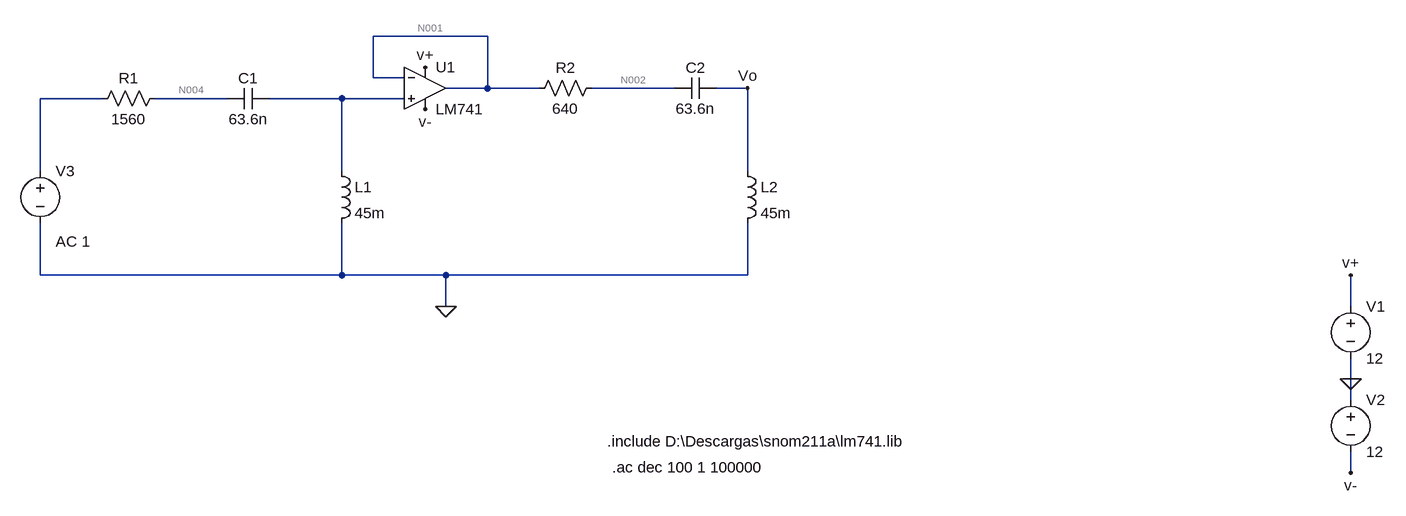
[diagram p0: schematic TS3.asc]
TS3.asc, the LTspice schematic file:
Version 4
SHEET 1 2296 964
WIRE 912 224 736 224
WIRE 736 288 736 224
WIRE 784 288 736 288
WIRE 912 304 912 224
WIRE 912 304 848 304
WIRE 992 304 912 304
WIRE 1200 304 1072 304
WIRE 1312 304 1264 304
WIRE 320 320 224 320
WIRE 512 320 400 320
WIRE 688 320 576 320
WIRE 784 320 688 320
WIRE 224 432 224 320
WIRE 688 432 688 320
WIRE 1312 432 1312 304
WIRE 224 592 224 512
WIRE 688 592 688 512
WIRE 688 592 224 592
WIRE 848 592 688 592
WIRE 1312 592 1312 512
WIRE 1312 592 848 592
WIRE 848 640 848 592
WIRE 2240 640 2240 592
WIRE 2240 752 2240 720
WIRE 2240 784 2240 752
WIRE 2240 896 2240 864
FLAG 2240 752 0
FLAG 2240 592 v+
FLAG 2240 896 v-
FLAG 816 272 v+
FLAG 816 336 v-
FLAG 848 640 0
FLAG 1312 304 Vo
SYMBOL voltage 2240 624 R0
WINDOW 123 0 0 Left 0
WINDOW 39 0 0 Left 0
SYMATTR InstName V1
SYMATTR Value 12
SYMBOL voltage 2240 768 R0
WINDOW 123 0 0 Left 0
WINDOW 39 0 0 Left 0
SYMATTR InstName V2
SYMATTR Value 12
SYMBOL OpAmps\\opamp2 816 240 R0
SYMATTR InstName U1
SYMATTR Value LM741
SYMBOL voltage 224 416 R0
WINDOW 123 24 124 Left 2
WINDOW 39 0 0 Left 0
SYMATTR InstName V3
SYMATTR Value ""
SYMATTR Value2 AC 1
SYMBOL res 416 304 R90
WINDOW 0 0 56 VBottom 2
WINDOW 3 32 56 VTop 2
SYMATTR InstName R1
SYMATTR Value 1560
SYMBOL cap 576 304 R90
WINDOW 0 0 32 VBottom 2
WINDOW 3 32 32 VTop 2
SYMATTR InstName C1
SYMATTR Value 63.6n
SYMBOL ind 672 416 R0
SYMATTR InstName L1
SYMATTR Value 45m
SYMBOL ind 1296 416 R0
SYMATTR InstName L2
SYMATTR Value 45m
SYMBOL cap 1264 288 R90
WINDOW 0 0 32 VBottom 2
WINDOW 3 32 32 VTop 2
SYMATTR InstName C2
SYMATTR Value 63.6n
SYMBOL res 1088 288 R90
WINDOW 0 0 56 VBottom 2
WINDOW 3 32 56 VTop 2
SYMATTR InstName R2
SYMATTR Value 640
TEXT 1096 848 Left 2 !.include D:\\Descargas\\snom211a\\lm741.lib
TEXT 1104 888 Left 2 !.ac dec 100 1 100000

The netlist it stands for:
* TS3.asc
V1 v+ 0 12
V2 0 v- 12
XU1 N005 N001 v+ v- N001 LM741  ; pins In+ In- V+ V- OUT
V3 N003 0 AC 1
R1 N004 N003 1560
C1 N005 N004 63.6n
L1 N005 0 45m
L2 Vo 0 45m
C2 Vo N002 63.6n
R2 N002 N001 640
.include D:\Descargas\snom211a\lm741.lib
.ac dec 100 1 100000
.backanno
.end

* Results of the author's LTspice run, read from the files saved beside the schematic
* Operating Point, zero values left out:
*   V(v+) = 12 V
*   V(v-) = -12 V
*   V(n001) = 1 mV
*   V(n002) = 1 mV
*   I(L1) = -57.86 nA
*   I(V2) = -1.626 mA
*   I(V1) = -1.626 mA
*   Ix(u1:1) = 57.86 nA
*   Ix(u1:2) = 101.9 nA
*   Ix(u1:99) = 1.626 mA
*   Ix(u1:50) = -1.626 mA
*   Ix(u1:28) = -101.9 nA
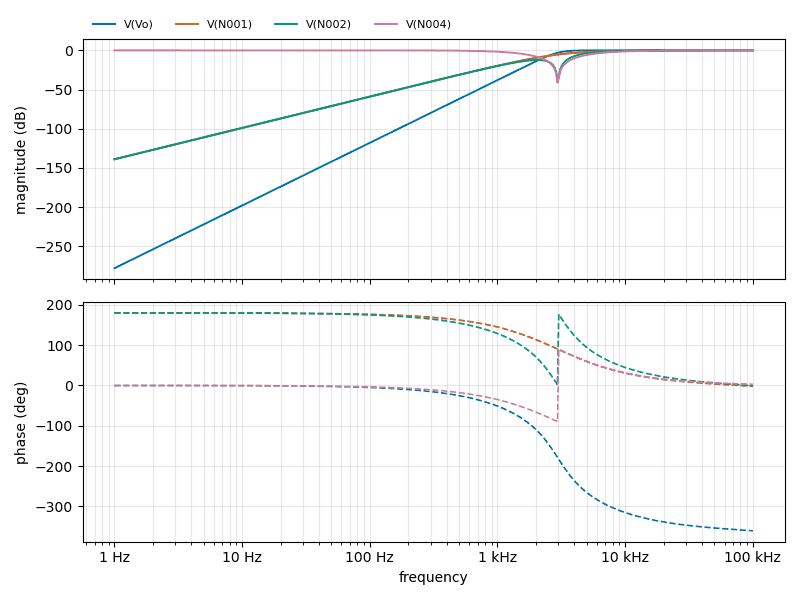
[diagram p1: AC Analysis of TS3.asc, plotted from the saved traces]
* AC Analysis, 1 run:
*   V(Vo): -277.88 dB at 1 Hz, -0.01 dB at 100 kHz, peak -0.01 dB at 42.66 kHz, 3 dB below the peak at 2.971 kHz
*   V(N001): -138.94 dB at 1 Hz, -0.01 dB at 100 kHz, peak -0.01 dB at 100 kHz, 3 dB below the peak at 4.15 kHz
*   V(N002): -138.94 dB at 1 Hz, -0.02 dB at 100 kHz, peak -0.02 dB at 100 kHz, 3 dB below the peak at 5.521 kHz
*   V(N004): -0.00 dB at 1 Hz, -0.01 dB at 100 kHz, peak -0.00 dB at 1 Hz, 3 dB below the peak at 1.298 kHz